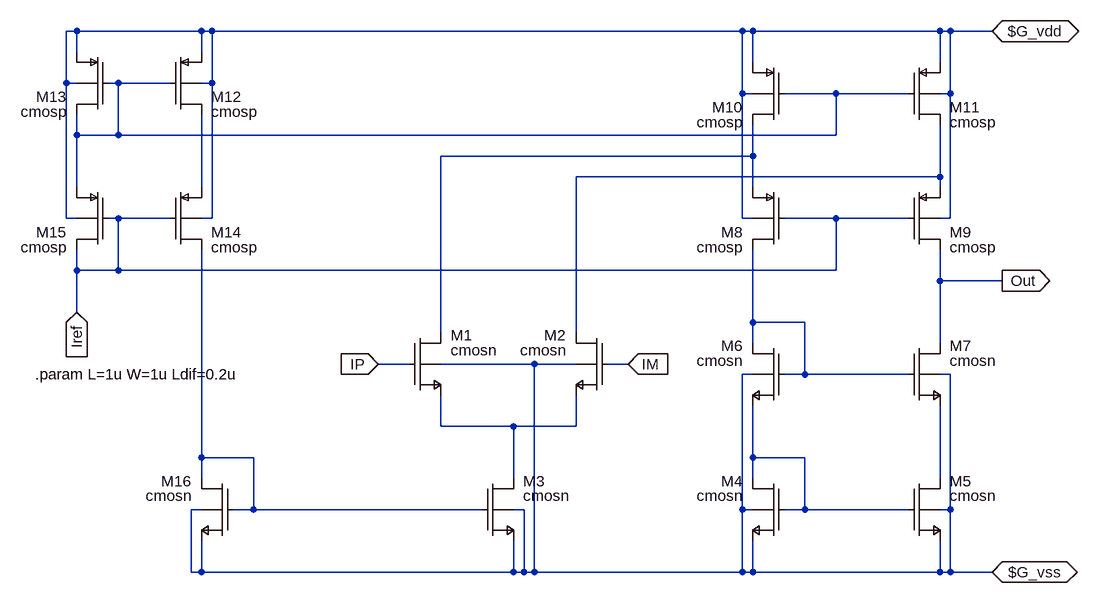
[diagram p0: schematic ao_cp_n.asc]
ao_cp_n.asc, the LTspice schematic file:
Version 4
SHEET 1 2836 1240
WIRE 464 -448 448 -448
WIRE 656 -448 464 -448
WIRE 672 -448 656 -448
WIRE 1488 -448 672 -448
WIRE 1504 -448 1488 -448
WIRE 1792 -448 1504 -448
WIRE 1808 -448 1792 -448
WIRE 1872 -448 1808 -448
WIRE 464 -416 464 -448
WIRE 656 -416 656 -448
WIRE 1504 -400 1504 -448
WIRE 1792 -400 1792 -448
WIRE 448 -368 448 -448
WIRE 464 -368 448 -368
WIRE 528 -368 512 -368
WIRE 608 -368 528 -368
WIRE 672 -368 672 -448
WIRE 672 -368 656 -368
WIRE 1488 -352 1488 -448
WIRE 1504 -352 1488 -352
WIRE 1632 -352 1552 -352
WIRE 1744 -352 1632 -352
WIRE 1808 -352 1808 -448
WIRE 1808 -352 1792 -352
WIRE 464 -288 464 -320
WIRE 528 -288 528 -368
WIRE 528 -288 464 -288
WIRE 1632 -288 1632 -352
WIRE 1632 -288 528 -288
WIRE 1504 -256 1504 -304
WIRE 1504 -256 1024 -256
WIRE 1792 -224 1792 -304
WIRE 1792 -224 1232 -224
WIRE 464 -208 464 -288
WIRE 656 -208 656 -320
WIRE 1504 -208 1504 -256
WIRE 1792 -208 1792 -224
WIRE 448 -160 448 -368
WIRE 464 -160 448 -160
WIRE 528 -160 512 -160
WIRE 608 -160 528 -160
WIRE 672 -160 672 -368
WIRE 672 -160 656 -160
WIRE 1488 -160 1488 -352
WIRE 1504 -160 1488 -160
WIRE 1632 -160 1552 -160
WIRE 1744 -160 1632 -160
WIRE 1808 -160 1808 -352
WIRE 1808 -160 1792 -160
WIRE 464 -80 464 -112
WIRE 528 -80 528 -160
WIRE 528 -80 464 -80
WIRE 1632 -80 1632 -160
WIRE 1632 -80 528 -80
WIRE 1792 -64 1792 -112
WIRE 1888 -64 1792 -64
WIRE 464 -16 464 -80
WIRE 1504 0 1504 -112
WIRE 1584 0 1504 0
WIRE 1024 16 1024 -256
WIRE 1232 16 1232 -224
WIRE 1504 32 1504 0
WIRE 1792 32 1792 -64
WIRE 976 64 928 64
WIRE 1168 64 1024 64
WIRE 1232 64 1168 64
WIRE 1312 64 1280 64
WIRE 1504 80 1488 80
WIRE 1584 80 1584 0
WIRE 1584 80 1552 80
WIRE 1744 80 1584 80
WIRE 1808 80 1792 80
WIRE 1024 160 1024 112
WIRE 1136 160 1024 160
WIRE 1232 160 1232 112
WIRE 1232 160 1136 160
WIRE 656 208 656 -112
WIRE 736 208 656 208
WIRE 1504 208 1504 128
WIRE 1584 208 1504 208
WIRE 656 240 656 208
WIRE 1136 240 1136 160
WIRE 1504 240 1504 208
WIRE 1792 240 1792 128
WIRE 656 288 640 288
WIRE 736 288 736 208
WIRE 736 288 704 288
WIRE 1088 288 736 288
WIRE 1152 288 1136 288
WIRE 1488 288 1488 80
WIRE 1504 288 1488 288
WIRE 1584 288 1584 208
WIRE 1584 288 1552 288
WIRE 1744 288 1584 288
WIRE 1808 288 1808 80
WIRE 1808 288 1792 288
WIRE 640 384 640 288
WIRE 656 384 656 336
WIRE 656 384 640 384
WIRE 1136 384 1136 336
WIRE 1136 384 656 384
WIRE 1152 384 1152 288
WIRE 1152 384 1136 384
WIRE 1168 384 1168 64
WIRE 1168 384 1152 384
WIRE 1488 384 1488 288
WIRE 1488 384 1168 384
WIRE 1504 384 1504 336
WIRE 1504 384 1488 384
WIRE 1792 384 1792 336
WIRE 1792 384 1504 384
WIRE 1808 384 1808 288
WIRE 1808 384 1792 384
WIRE 1872 384 1808 384
FLAG 928 64 IP
IOPIN 928 64 In
FLAG 1888 -64 Out
IOPIN 1888 -64 Out
FLAG 1312 64 IM
IOPIN 1312 64 In
FLAG 1872 -448 $G_vdd
IOPIN 1872 -448 BiDir
FLAG 1872 384 $G_vss
IOPIN 1872 384 BiDir
FLAG 464 -16 Iref
IOPIN 464 -16 In
SYMBOL nmosb 976 16 R0
SYMATTR InstName M1
SYMATTR Value cmosn
SYMATTR Value2 l={L} w={W} ad={Ldif*W} as={Ldif*W} pd={(Ldif+W)*2} ps={(Ldif+W)*2} m=1
SYMBOL pmosb 1552 -208 M0
SYMATTR InstName M8
SYMATTR Value cmosp
SYMATTR Value2 l={L} w={W} ad={Ldif*W} as={Ldif*W} pd={(Ldif+W)*2} ps={(Ldif+W)*2} m=1
SYMBOL nmosb 1280 16 M0
SYMATTR InstName M2
SYMATTR Value cmosn
SYMATTR Value2 l={L} w={W} ad={Ldif*W} as={Ldif*W} pd={(Ldif+W)*2} ps={(Ldif+W)*2} m=1
SYMBOL nmosb 1088 240 R0
SYMATTR InstName M3
SYMATTR Value cmosn
SYMATTR Value2 l={L} w={W} ad={Ldif*W} as={Ldif*W} pd={(Ldif+W)*2} ps={(Ldif+W)*2} m=1
SYMBOL nmosb 1552 240 M0
SYMATTR InstName M4
SYMATTR Value cmosn
SYMATTR Value2 l={L} w={W} ad={Ldif*W} as={Ldif*W} pd={(Ldif+W)*2} ps={(Ldif+W)*2} m=1
SYMBOL nmosb 1744 240 R0
SYMATTR InstName M5
SYMATTR Value cmosn
SYMATTR Value2 l={L} w={W} ad={Ldif*W} as={Ldif*W} pd={(Ldif+W)*2} ps={(Ldif+W)*2} m=1
SYMBOL nmosb 1552 32 M0
SYMATTR InstName M6
SYMATTR Value cmosn
SYMATTR Value2 l={L} w={W} ad={Ldif*W} as={Ldif*W} pd={(Ldif+W)*2} ps={(Ldif+W)*2} m=1
SYMBOL nmosb 1744 32 R0
SYMATTR InstName M7
SYMATTR Value cmosn
SYMATTR Value2 l={L} w={W} ad={Ldif*W} as={Ldif*W} pd={(Ldif+W)*2} ps={(Ldif+W)*2} m=1
SYMBOL pmosb 1744 -208 R0
SYMATTR InstName M9
SYMATTR Value cmosp
SYMATTR Value2 l={L} w={W} ad={Ldif*W} as={Ldif*W} pd={(Ldif+W)*2} ps={(Ldif+W)*2} m=1
SYMBOL pmosb 1552 -400 M0
SYMATTR InstName M10
SYMATTR Value cmosp
SYMATTR Value2 l={L} w={W} ad={Ldif*W} as={Ldif*W} pd={(Ldif+W)*2} ps={(Ldif+W)*2} m=1
SYMBOL pmosb 1744 -400 R0
SYMATTR InstName M11
SYMATTR Value cmosp
SYMATTR Value2 l={L} w={W} ad={Ldif*W} as={Ldif*W} pd={(Ldif+W)*2} ps={(Ldif+W)*2} m=1
SYMBOL pmosb 608 -416 R0
SYMATTR InstName M12
SYMATTR Value cmosp
SYMATTR Value2 l={L} w={W} ad={Ldif*W} as={Ldif*W} pd={(Ldif+W)*2} ps={(Ldif+W)*2} m=1
SYMBOL pmosb 512 -416 M0
SYMATTR InstName M13
SYMATTR Value cmosp
SYMATTR Value2 l={L} w={W} ad={Ldif*W} as={Ldif*W} pd={(Ldif+W)*2} ps={(Ldif+W)*2} m=1
SYMBOL pmosb 608 -208 R0
SYMATTR InstName M14
SYMATTR Value cmosp
SYMATTR Value2 l={L} w={W} ad={Ldif*W} as={Ldif*W} pd={(Ldif+W)*2} ps={(Ldif+W)*2} m=1
SYMBOL pmosb 512 -208 M0
SYMATTR InstName M15
SYMATTR Value cmosp
SYMATTR Value2 l={L} w={W} ad={Ldif*W} as={Ldif*W} pd={(Ldif+W)*2} ps={(Ldif+W)*2} m=1
SYMBOL nmosb 704 240 M0
SYMATTR InstName M16
SYMATTR Value cmosn
SYMATTR Value2 l={L} w={W} ad={Ldif*W} as={Ldif*W} pd={(Ldif+W)*2} ps={(Ldif+W)*2} m=1
TEXT 400 80 Left 2 !.param L=1u W=1u Ldif=0.2u

The netlist it stands for:
* ao_cp_n.asc
M1 N002 IP N006 $G_vss cmosn l={L} w={W} ad={Ldif*W} as={Ldif*W} pd={(Ldif+W)*2} ps={(Ldif+W)*2} m=1
M8 N005 Iref N002 $G_vdd cmosp l={L} w={W} ad={Ldif*W} as={Ldif*W} pd={(Ldif+W)*2} ps={(Ldif+W)*2} m=1
M2 N003 IM N006 $G_vss cmosn l={L} w={W} ad={Ldif*W} as={Ldif*W} pd={(Ldif+W)*2} ps={(Ldif+W)*2} m=1
M3 N006 N007 $G_vss $G_vss cmosn l={L} w={W} ad={Ldif*W} as={Ldif*W} pd={(Ldif+W)*2} ps={(Ldif+W)*2} m=1
M4 N008 N008 $G_vss $G_vss cmosn l={L} w={W} ad={Ldif*W} as={Ldif*W} pd={(Ldif+W)*2} ps={(Ldif+W)*2} m=1
M5 N009 N008 $G_vss $G_vss cmosn l={L} w={W} ad={Ldif*W} as={Ldif*W} pd={(Ldif+W)*2} ps={(Ldif+W)*2} m=1
M6 N005 N005 N008 $G_vss cmosn l={L} w={W} ad={Ldif*W} as={Ldif*W} pd={(Ldif+W)*2} ps={(Ldif+W)*2} m=1
M7 Out N005 N009 $G_vss cmosn l={L} w={W} ad={Ldif*W} as={Ldif*W} pd={(Ldif+W)*2} ps={(Ldif+W)*2} m=1
M9 Out Iref N003 $G_vdd cmosp l={L} w={W} ad={Ldif*W} as={Ldif*W} pd={(Ldif+W)*2} ps={(Ldif+W)*2} m=1
M10 N002 N001 $G_vdd $G_vdd cmosp l={L} w={W} ad={Ldif*W} as={Ldif*W} pd={(Ldif+W)*2} ps={(Ldif+W)*2} m=1
M11 N003 N001 $G_vdd $G_vdd cmosp l={L} w={W} ad={Ldif*W} as={Ldif*W} pd={(Ldif+W)*2} ps={(Ldif+W)*2} m=1
M12 N004 N001 $G_vdd $G_vdd cmosp l={L} w={W} ad={Ldif*W} as={Ldif*W} pd={(Ldif+W)*2} ps={(Ldif+W)*2} m=1
M13 N001 N001 $G_vdd $G_vdd cmosp l={L} w={W} ad={Ldif*W} as={Ldif*W} pd={(Ldif+W)*2} ps={(Ldif+W)*2} m=1
M14 N007 Iref N004 $G_vdd cmosp l={L} w={W} ad={Ldif*W} as={Ldif*W} pd={(Ldif+W)*2} ps={(Ldif+W)*2} m=1
M15 Iref Iref N001 $G_vdd cmosp l={L} w={W} ad={Ldif*W} as={Ldif*W} pd={(Ldif+W)*2} ps={(Ldif+W)*2} m=1
M16 N007 N007 $G_vss $G_vss cmosn l={L} w={W} ad={Ldif*W} as={Ldif*W} pd={(Ldif+W)*2} ps={(Ldif+W)*2} m=1
.model NMOS NMOS
.model PMOS PMOS
.lib standard.mos
.param L=1u W=1u Ldif=0.2u
.backanno
.end